# EAGLE design Pi Zero PITS (EAGLE 9.6.2)
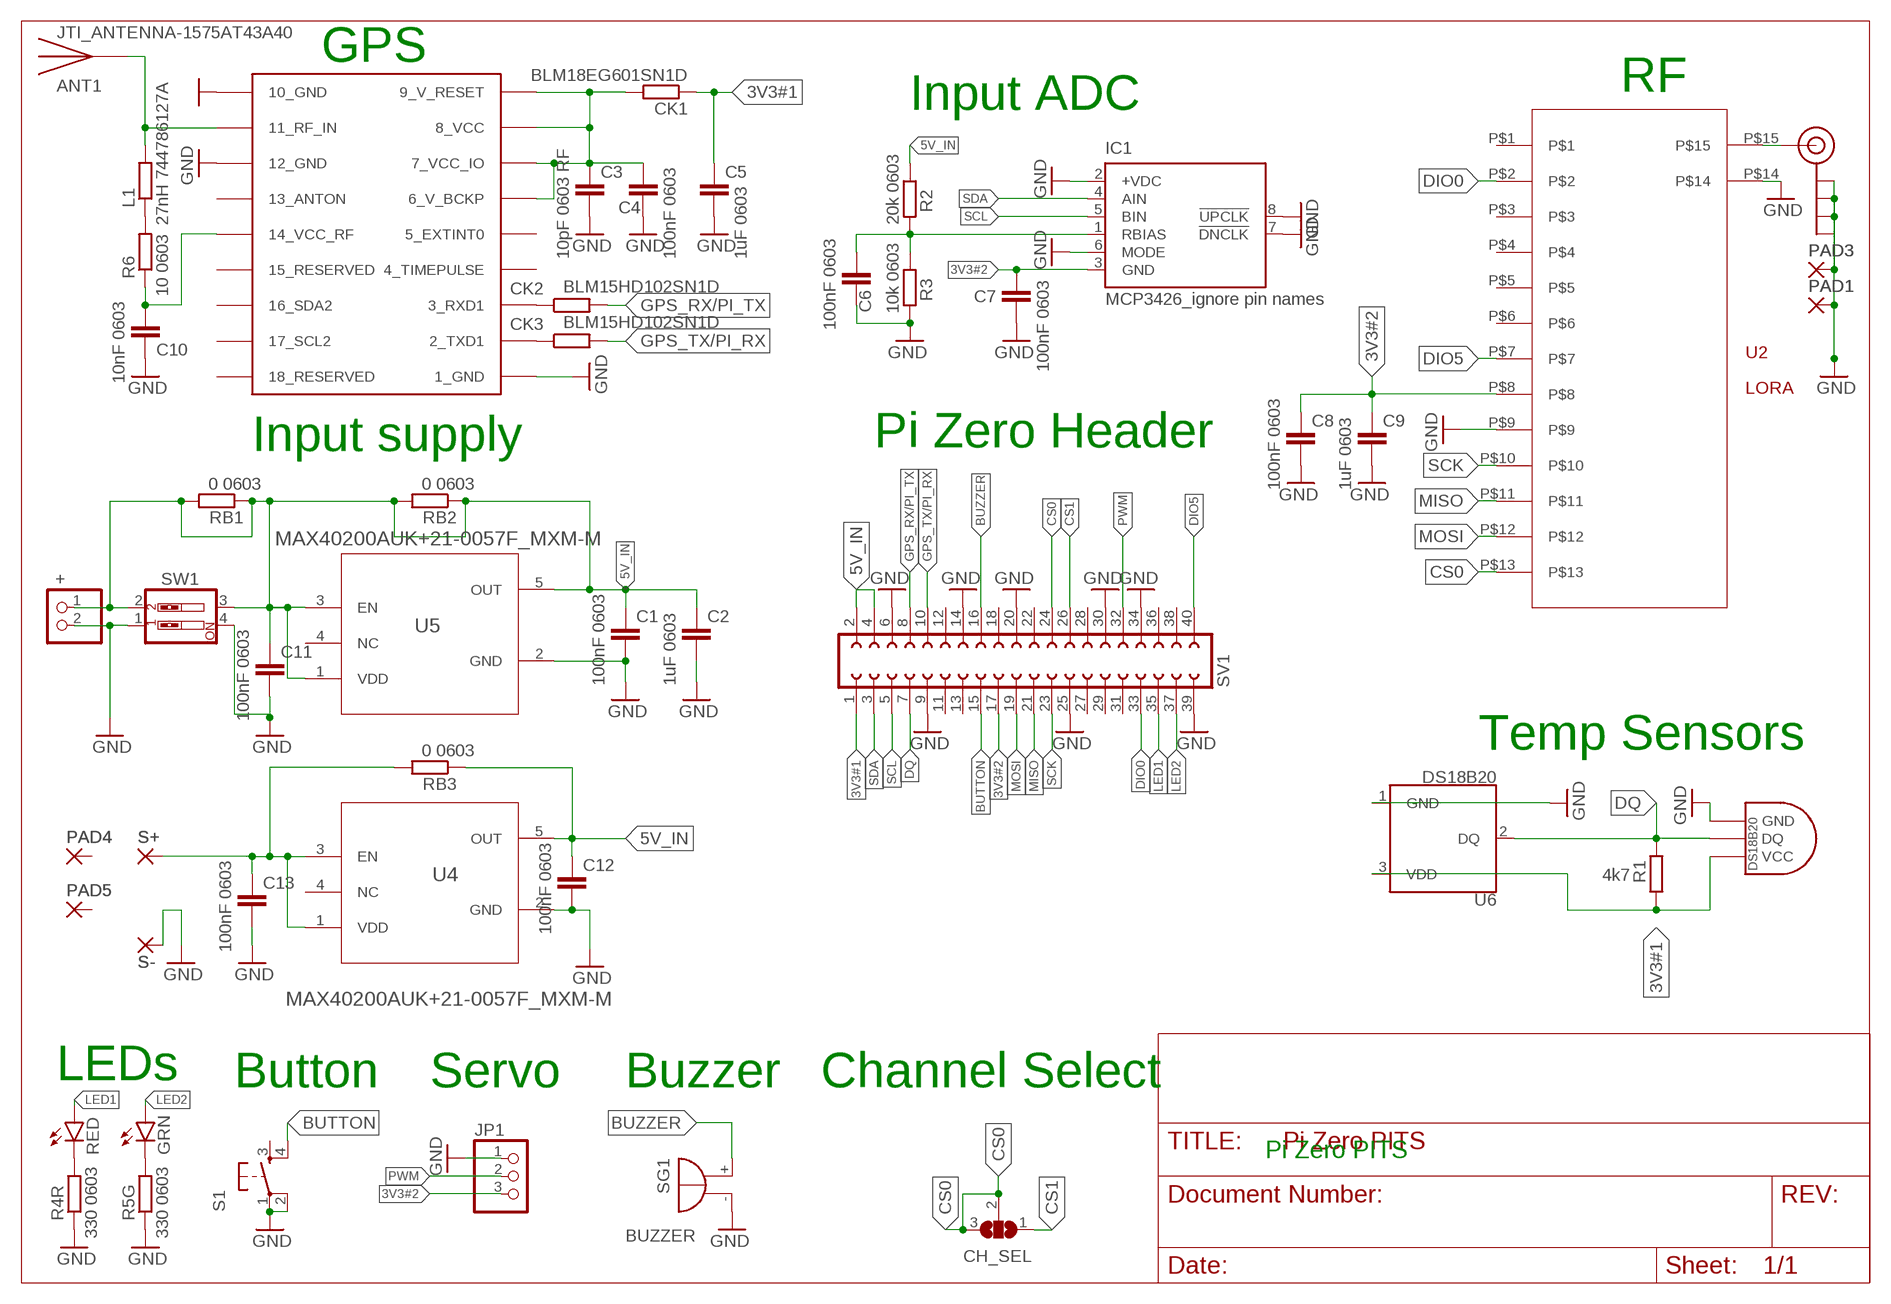
[diagram p0: schematic, sheet 1]

## Parts
18B20Z  DS1820SOIC  [DS18B20_SOIC]
+  PINHD-1X2  [1X02]
ANT1  JTI_ANTENNA-1575AT43A40  [JTI_ANTENNA-1575AT43A40]
C1  100nF 0603  C-EUC0603K  [C0603K]
C2  1uF 0603  C-EUC0603K  [C0603K]
C3  10pF 0603 RF  C-EUC0603K  [C0603K]
C4  100nF 0603  C-EUC0603K  [C0603K]
C5  1uF 0603  C-EUC0603K  [C0603K]
C6  100nF 0603  C-EUC0603K  [C0603K]
C7  100nF 0603  C-EUC0603K  [C0603K]
C8  100nF 0603  C-EUC0603K  [C0603K]
C9  1uF 0603  C-EUC0603K  [C0603K]
C10  10nF 0603  C-EUC0603K  [C0603K]
C11  100nF 0603  C-EUC0603K  [C0603K]
C12  100nF 0603  C-EUC0603K  [C0603K]
C13  100nF 0603  C-EUC0603K  [C0603K]
CH_SEL  SJ2W  [SJ_2]
CK1  BLM18EG601SN1D  R-EU_R0603  [R0603]
CK2  BLM15HD102SN1D  R-EU_R0402  [R0402]
CK3  BLM15HD102SN1D  R-EU_R0402  [R0402]
GRN  LEDSML0603  [SML0603]
IC1  MCP3426_ignore pin names  LS7183-SOIC  [SOIC08]
J$2  SMA_EDGE  [SMA-EDGE]
JP1  PINHD-1X3  [1X03]
L1  27nH 744786127A  R-EU_R0603  [R0603]
PAD1  SMD5  [SMD2,54-5,08]
PAD3  SMD5  [SMD2,54-5,08]
PAD4  SMD2SMD_KW  [SMD_SMALL]
PAD5  SMD2SMD_KW  [SMD_SMALL]
R1  4k7  R-EU_R0603  [R0603]
R2  20k 0603  R-EU_R0603  [R0603]
R3  10k 0603  R-EU_R0603  [R0603]
R4R  330 0603  R-EU_R0603  [R0603]
R5G  330 0603  R-EU_R0603  [R0603]
R6  10 0603  R-EU_R0603  [R0603]
RB1  0 0603  R-EU_R0603  [R0603]
RB2  0 0603  R-EU_R0603  [R0603]
RB3  0 0603  R-EU_R0603  [R0603]
RED  LEDSML0603  [SML0603]
S1  DTS-6  [DTS-6]
S+  SMD2SMD_KW  [SMD_SMALL]
S-  S-  SMD2SMD_KW  [SMD_SMALL]
SG1  BUZZER  BMT1205XH7.5  [BMT1205XH7.5]
SV1  FE20-2  [FE20-2]
SW1  SW_DIP-2  [EDG-02]
U1  U1  UBLOX_MAX-6  [UBLOX_MAX-6]
U2  LORA  [LORA_DRF]
U4  MAX40200AUK+21-0057F_MXM-M  [21-0057F_MXM-M]
U5  MAX40200AUK+21-0057F_MXM-M  [21-0057F_MXM-M]
U6  DS18B20  [TO-92-TO92127P495H2044-3]

## Nets
3V3#1: 18B20Z.VCC C5.1 CK1.1 R1.1 SV1.1 U6.3(VDD)
3V3#2: C7.1 C8.1 C9.1 IC1.3(GND) JP1.3 SV1.17 U2.P$8
5V_IN: +.1 C1.1 C2.1 C11.1 C12.1 R2.1 RB1.1 RB1.2 RB2.1 RB2.2 RB3.1 SV1.2 SV1.4 SW1.2 SW1.3 U4.5(OUT) U5.1(VDD) U5.3(EN) U5.5(OUT)
BUTTON: S1.4 SV1.15
BUZZER: SG1.+ SV1.16
CS0: CH_SEL.2 CH_SEL.3 SV1.24 U2.P$13
CS1: CH_SEL.1 SV1.26
DIO0: SV1.33 U2.P$2
DIO5: SV1.40 U2.P$7
DQ: 18B20Z.DQ R1.2 SV1.7 U6.2(DQ)
GND: 18B20Z.GND +.2 C1.2 C2.2 C3.2 C4.2 C5.2 C6.2 C7.2 C8.2 C9.2 C10.2 C11.2 C12.2 C13.2 IC1.2(+VDC) IC1.6(MODE) IC1.7(!DNCLK) IC1.8(!UPCLK) J$2.GND@0(GND) J$2.GND@1(GND) J$2.GND@2(GND) J$2.GND@3(GND) JP1.1 PAD1.1(P) PAD3.1(P) R3.2 R4R.1 R5G.1 S1.1 S1.2 S-.1(P) SG1.- SV1.6 SV1.9 SV1.14 SV1.20 SV1.25 SV1.30 SV1.34 SV1.39 SW1.1 SW1.4 U1.1_GND U1.10_GND U1.12_GND U2.P$9 U2.P$14 U4.2(GND) U5.2(GND) U6.1(GND)
GPS_RX/PI_TX: CK2.2 SV1.8
GPS_TX/PI_RX: CK3.2 SV1.10
LED1: RED.A SV1.35
LED2: GRN.A SV1.37
MISO: SV1.21 U2.P$11
MOSI: SV1.19 U2.P$12
N$2: J$2.SIG(SIGNAL) U2.P$15
N$3: GRN.C R5G.2
N$7: CK2.1 U1.3_RXD1
N$8: R4R.2 RED.C
N$9: CK3.1 U1.2_TXD1
N$11: C10.1 R6.1 U1.14_VCC_RF
N$14: ANT1.FEED L1.2 U1.11_RF_IN
N$15: C6.1 IC1.1(RBIAS) R2.2 R3.1
N$16: L1.1 R6.2
N$17: C3.1 C4.1 CK1.2 U1.6_V_BCKP U1.7_VCC_IO U1.8_VCC U1.9_V_RESET
N$19: C13.1 RB3.2 S+.1(P) U4.1(VDD) U4.3(EN)
PWM: JP1.2 SV1.32
SCK: SV1.23 U2.P$10
SCL: IC1.5(BIN) SV1.5
SDA: IC1.4(AIN) SV1.3
Unconnected: PAD4.1(P) PAD5.1(P) S1.3 SV1.11 SV1.12 SV1.13 SV1.18 SV1.22 SV1.27 SV1.28 SV1.29 SV1.31 SV1.36 SV1.38 U1.4_TIMEPULSE U1.5_EXTINT0 U1.13_ANTON U1.15_RESERVED U1.16_SDA2 U1.17_SCL2 U1.18_RESERVED U2.P$1 U2.P$3 U2.P$4 U2.P$5 U2.P$6 U4.4(NC) U5.4(NC)

## Notes on the sheet
- GPS
- RF
- Input ADC
- Input supply | Pi Zero Header
- Temp Sensors
- LEDs | Button | Servo | Buzzer | Channel Select
- Pi Zero PITS

## Library data of the parts
18B20Z = ava:DS1820: DS18B20 Programmable Resolution 1-Wire Digital Thermometer Description The DS18B20 digital thermometer provides 9-bit to 12-bit Celsius temperature measurements and has an alarm function with nonvolatile user-programmable upper and lower trigger points. The DS18B20 communicates over a 1-Wire® bus that by definition requires only one data line (and ground) for communication with a central microprocessor. It has an operating temperature range of -55°C to +125°C and is accurate to ±0.5°C over the range of -10°C to +85°C. In addition, the DS18B20 can derive power directly from the data line ("parasite power"), eliminating the need for an external power supply. Each DS18B20 has a unique 64-bit serial code, which allows multiple DS18B20s to function on the same 1-Wire bus. Thus, it is simple to use one microprocessor to control many DS18B20s distributed over a large area. Applications that can benefit from this feature include HVAC environmental controls, temperature monitoring systems inside buildings, equipment, or machinery, and process monitoring and control systems.
+ = pinhead:PINHD-1X2: PIN HEADER
ANT1 = KEW_HF_V13:JTI_ANTENNA-1575AT43A40
C1-C13 = rcl:C-EU: CAPACITOR, European symbol; SPICEPREFIX: C
CH_SEL = jumper:SJ2W: SMD solder JUMPER
CK1-CK3 L1 R1-R3 R4R R5G R6 RB1-RB3 = rcl:R-EU_: RESISTOR, European symbol; SPICEPREFIX: R
GRN RED = led:LED: LED OSRAM: - CHIPLED LG R971, LG N971, LY N971, LG Q971, LY Q971, LO R971, LY R971 LH N974, LH R974 LS Q976, LO Q976, LY Q976 LO Q996 - Hyper CHIPLED LW Q18S LB Q993, LB Q99A, LB R99A - SideLED LS A670, LO A670, LY A670, LG A670, LP A670 LB A673, LV A673, LT A673, LW A673 LH A674 LY A675 LS A676, LA A676, LO A676, LY A676, LW A676 LS A679, LY A679, LG A679 - Hyper Micro SIDELED® LS Y876, LA Y876, LO Y876, LY Y876 LT Y87S - SmartLED LW L88C, LW L88S LB L89C, LB L89S, LG L890 LS L89K, LO L89K, LY L89K LS L896, LA L896, LO L896, LY L896 - TOPLED LS T670, LO T670, LY T670, LG T670, LP T670 LSG T670, LSP T670, LSY T670, LOP T670, LYG T670 LG T671, LOG T671, LSG T671 LB T673, LV T673, LT T673, LW T673 LH T674 LS T676, LA T676, LO T676, LY T676, LB T676, LH T676, LSB T676, LW T676 LB T67C, LV T67C, LT T67C, LS T67K, LO T67K, LY T67K, LW E67C LS E67B, LA E67B, LO E67B, LY E67B, LB E67C, LV E67C, LT E67C LW T67C LS T679, LY T679, LG T679 LS T770, LO T770, LY T770, LG T770, LP T770 LB T773, LV T773, LT T773, LW T773 LH T774 LS E675, LA E675, LY E675, LS T675 LS T776, LA T776, LO T776, LY T776, LB T776 LHGB T686 LT T68C, LB T68C - Hyper Mini TOPLED® LB M676 - Mini TOPLED Santana® LG M470 LS M47K, LO M47K, LY M47K Source: http://www.osram.convergy.de LUXEON: - LUMILED® LXK2-PW12-R00, LXK2-PW12-S00, LXK2-PW14-U00, LXK2-PW14-V00 LXK2-PM12-R00, LXK2-PM12-S00, LXK2-PM14-U00 LXK2-PE12-Q00, LXK2-PE12-R00, LXK2-PE12-S00, LXK2-PE14-T00, LXK2-PE14-U00 LXK2-PB12-K00, LXK2-PB12-L00, LXK2-PB12-M00, LXK2-PB14-N00, LXK2-PB14-P00, LXK2-PB14-Q00 LXK2-PR12-L00, LXK2-PR12-M00, LXK2-PR14-Q00, LXK2-PR14-R00 LXK2-PD12-Q00, LXK2-PD12-R00, LXK2-PD12-S00 LXK2-PH12-R00, LXK2-PH12-S00 LXK2-PL12-P00, LXK2-PL12-Q00, LXK2-PL12-R00 Source: www.luxeon.com KINGBRIGHT: KA-3528ASYC Source: www.kingbright.com
IC1 = optocoupler:LS7183: Encoder to Counter Interface Source: http://www.usdigital.com/products/ls7183-ls7184/ls7183 ls7184 Data Sheet.pdf; OC_FARNELL: unknown; OC_NEWARK: unknown
J$2 = SparkFun:SMA_EDGE: SMA Antenna Connector End launch SMA connector. The paste layer has been removed so that the connector can be hand soldered onto the board after reflow.
JP1 = pinhead:PINHD-1X3: PIN HEADER
PAD1 PAD3 = wirepad:SMD5: SMD PAD
PAD4 PAD5 S+ S- = KEW_HF_V13:SMD2: SMD PAD
S1 = switch-tact:DTS-6
SG1 = buzzer:BMT1205XH7.5: MAGNETIC TRANSDUCER Source: Http:www.be-star.com; OC_FARNELL: unknown; OC_NEWARK: unknown
SV1 = con-lsta_new:FE20-2: FEMALE HEADER; OC_FARNELL: unknown; OC_NEWARK: unknown
SW1 = special:SW_DIP-2: DIP SWITCH
U1 = ava:UBLOX_MAX-6: UBLOX MAX-6
U2 = lora:LORA
U4 U5 = KEW_HF_V13:MAX40200AUK+; BUILT_BY: EMA_UL_Team; COPYRIGHT: Copyright (C) 2018 Accelerated Designs. All rights reserved; MANUFACTURER_PART_NUMBER: MAX40200AUK+; SOURCELIBRARY: Maxim_2018-11-30; VENDOR: Maxim Integrated Products
U6 = DS18B20:DS18B20: digital thermometer -55C-125C TO92-3 Check prices <https://pricing.snapeda.com/parts/DS18B20/Maxim%20Integrated/view-part?ref=eda>; AVAILABILITY: Bad; DESCRIPTION: Temperature Sensor Digital, Local -55°C ~ 125°C 12 b 8-SOIC; MF: Maxim Integrated; MP: DS18B20; PACKAGE: TO-226-3 Maxim; PRICE: None

## Net classes
0 default: width 0.152 mm, drill 0.305 mm, clearance 0.152 mm
1 vcc: width 0.152 mm, clearance 0.152 mm

## Board
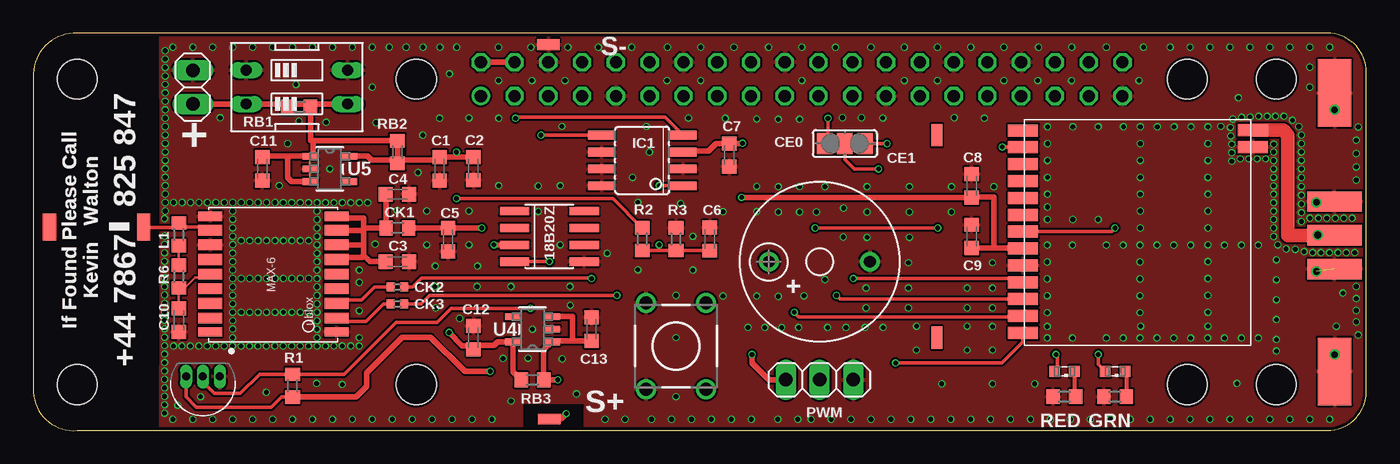
[diagram p1: board, top side]
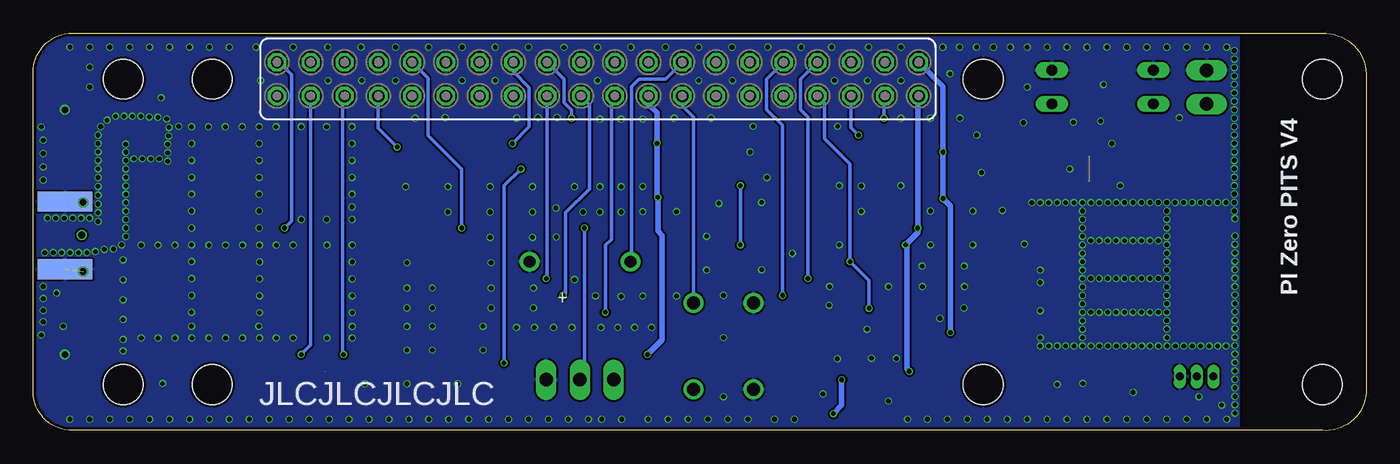
[diagram p2: board, bottom side, seen from below]

Size 100.25 x 29.9 mm. Coordinates in mm from the lower left corner, seen from the top.
Outline: 3.3,29.9 arc90 0,26.85 0,2.85 arc90 3.3,0.01 97.33,0.01 arc90 100.25,2.93 100.25,26.98 arc90 97.33,29.9 3.3,29.9
Copper layers (1*16): Top 0.035559375mm / dielectric 1.6mm / Bottom 0.035559375mm
Design rules "JLCpcb-2-layer-KW-Master": minimum track width 6mil, minimum drill 0.3mm, track to track 6mil, track to pad 6mil, pad to pad 6mil, via to via 10mil, smd to smd 6mil, copper to edge 8mil, drill to drill 6mil, minimum pad ring 5mil, minimum via ring 3mil, stop-mask expansion 2.5mil, vias tented up to drill 25mil, thermal gap 6mil
Holes 3 mm at 28.81,26.45 86.8,26.45 28.81,3.46 86.8,3.46 3.31,26.45 3.31,3.46 93.48,26.45 93.48,3.46
tKeepout: area 86.8,3.4 to 86.8,3.4; area 86.8,26.3 to 86.8,26.3; area 28.8,26.3 to 28.8,26.3; area 28.8,3.3 to 28.8,3.3
tRestrict: area 0,4.9 to 9.5,24.9; area 36.9,0 to 41.4,1.9; area 18.6,23.8 to 21.4,25; area 26.8,19.6 to 28,22.4

### Footprints (pad centres in the part's own frame; a part is rotated, then mirrored left to right if it is on the bottom)
DS18B20_SOIC = smd 0.61 x 2.21: DQ 1.905,-2.616; GND 1.905,2.616; NC -1.905,-2.616; NC2 -0.635,-2.616; NC3 -1.905,2.616; NC4 -0.635,2.616; NC5 0.635,2.616; VCC 0.635,-2.616
1X02 = drill 1.016 long: 1 -1.27,0; 2 1.27,0
JTI_ANTENNA-1575AT43A40 = smd 1 x 2: FEED -3.81,-1.27; NC 3.29,-1.27
C0603K = smd 1.05 x 1.08: 1 -0.875,0; 2 0.875,0
SJ_2 = smd 1.168 x 1.6: 1 -1.524,0; 2 0,0; 3 1.524,0
R0603 = smd 1 x 1.1: 1 -0.85,0; 2 0.85,0
R0402 = smd 0.6 x 0.7: 1 -0.5,0; 2 0.5,0
SML0603 = smd 0.8 x 0.8: A 0.75,0; C -0.75,0
SOIC08 = smd 0.66 x 2.032: 1 -1.905,-3.073; 2 -0.635,-3.073; 3 0.635,-3.073; 4 1.905,-3.073; 5 1.905,3.073; 6 0.635,3.073; 7 -0.635,3.073; 8 -1.905,3.073
SMA-EDGE = smd 1.524 x 4.064: GND@0 0,0; GND@1 5.08,0; SIG 2.54,0 | smd 1.524 x 4.064 bottom: GND@2 0,0; GND@3 5.08,0
1X03 = drill 1.016 long: 1 -2.54,0; 2 0,0; 3 2.54,0
SMD2,54-5,08 = smd 2.54 x 5.08: 1 0,0
SMD_SMALL = smd 0.813 x 1.676: 1 0,0
DTS-6 = drill 1: 1 -3.25,2.25; 2 3.25,2.25; 3 -3.25,-2.25; 4 3.25,-2.25
BMT1205XH7.5 = drill 0.9 pad 1.5: + 3.8,0; - -3.8,0
FE20-2 = drill 0.914: 1 -24.13,1.27 | drill 0.914 octagon: 2 -24.13,-1.27; 3 -21.59,1.27; 4 -21.59,-1.27; 5 -19.05,1.27; 6 -19.05,-1.27; 7 -16.51,1.27; 8 -16.51,-1.27; 9 -13.97,1.27; 10 -13.97,-1.27; 11 -11.43,1.27; 12 -11.43,-1.27; 13 -8.89,1.27; 14 -8.89,-1.27; 15 -6.35,1.27; 16 -6.35,-1.27; 17 -3.81,1.27; 18 -3.81,-1.27; 19 -1.27,1.27; 20 -1.27,-1.27; 21 1.27,1.27; 22 1.27,-1.27; 23 3.81,1.27; 24 3.81,-1.27; 25 6.35,1.27; 26 6.35,-1.27; 27 8.89,1.27; 28 8.89,-1.27; 29 11.43,1.27; 30 11.43,-1.27; 31 13.97,1.27; 32 13.97,-1.27; 33 16.51,1.27; 34 16.51,-1.27; 35 19.05,1.27; 36 19.05,-1.27; 37 21.59,1.27; 38 21.59,-1.27; 39 24.13,1.27; 40 24.13,-1.27
EDG-02 = drill 0.813 long: 1 -1.27,-3.81; 2 1.27,-3.81; 3 1.27,3.81; 4 -1.27,3.81
UBLOX_MAX-6 = smd 1.8 x 0.7: 1_GND 4.95,-4.4; 9_V_RESET 4.95,4.3; 10_GND -4.55,4.3; 18_RESERVED -4.55,-4.4 | smd 1.8 x 0.8: 2_TXD1 4.95,-3.35; 3_RXD1 4.95,-2.25; 4_TIMEPULSE 4.95,-1.15; 5_EXTINT0 4.95,-0.05; 6_V_BCKP 4.95,1.05; 7_VCC_IO 4.95,2.15; 8_VCC 4.95,3.25; 11_RF_IN -4.55,3.25; 12_GND -4.55,2.15; 13_ANTON -4.55,1.05; 14_VCC_RF -4.55,-0.05; 15_RESERVED -4.55,-1.15; 16_SDA2 -4.55,-2.25; 17_SCL2 -4.55,-3.35
LORA_DRF = smd 2.27 x 0.9: P$1 -8.609,7.497; P$2 -8.609,6.227; P$3 -8.608,4.958; P$4 -8.608,3.688; P$5 -8.609,2.417; P$6 -8.609,1.147; P$7 -8.608,-0.122; P$8 -8.608,-1.392; P$9 -8.61,-2.663; P$10 -8.61,-3.933; P$11 -8.609,-5.202; P$12 -8.609,-6.472; P$13 -8.609,-7.743; P$14 8.673,6.235; P$15 8.675,7.506
21-0057F_MXM-M = smd 1.181 x 0.508: 1 -1.467,0.95; 2 -1.467,0; 3 -1.467,-0.95; 4 1.467,-0.95; 5 1.467,0.95
TO-92-TO92127P495H2044-3 = drill 0.6 pad 0.813 long: 1 -1.27,-0.76; 2 0,-0.76; 3 1.27,-0.76

### Placement (x,y rotation side)
18B20Z  38.81,14.61 270 top
+  12,25.85 90 top
ANT1  4.5,14.05 180 top
C1  30.56,19.69 270 top
C2  33.1,19.72 270 top
C3  27.38,12.71 0 top
C4  27.38,17.79 0 top
C5  31.2,14.36 270 top
C6  50.88,14.41 90 top
C7  52.35,20.73 270 top
C8  70.56,18.42 90 top
C9  70.56,14.61 90 top
C10  10.95,8.31 270 top
C11  17.23,19.69 270 top
C12  33.1,6.99 90 top
C13  41.99,7.63 90 top
CH_SEL  61.04,21.6 180 top
CK1  27.38,15.25 180 top
CK2  27.38,10.8 0 top
CK3  27.38,9.53 0 top
GRN  81.36,4.45 180 top
IC1  45.8,20.33 90 top
J$2  97.86,12.15 90 top
JP1  59.14,3.82 180 top
L1  10.95,14.77 90 top
PAD1  97.87,4.45 180 top
PAD3  97.87,25.41 180 top
PAD4  67.96,22.23 0 top
PAD5  67.96,6.99 0 top
R1  19.51,3.38 90 top
R2  45.8,14.41 270 top
R3  48.34,14.41 90 top
R4R  77.55,2.55 0 top
R5G  81.36,2.55 0 top
R6  10.95,11.59 90 top
RB1  20,24.35 180 top
RB2  27.38,20.96 90 top
RB3  37.55,3.82 0 top
RED  77.55,4.45 180 top
S1  48.34,6.36 90 top
S+  38.81,0.87 90 top
S-  38.74,29.04 90 top
SG1  59.14,12.71 180 top
SV1  57.79,26.45 180 bottom
SW1  19.83,25.85 270 top
U1  17.86,11.82 0 top
U2  83.04,15.09 0 top
U4  37.55,7.63 180 top
U5  22.3,19.69 0 top
U6  12.75,3.31 180 top

### Tracks (layer width: path | path; a pad name or v marks a point on that pad's centre or on a via)
3V3#1  (via drill 0.35)  (1 unrouted)
  Top 0.254: R1.1 18.67,2.53 17.88,1.74 12.27,1.74 11.48,2.53 U6.3
  Top 0.406: CK1.1 31.18,15.25 C5.1 33.72,15.23 v33.73,15.25 | 18B20Z.VCC v34.65,13.98 | v34.37,4.45 32.47,4.45 29.9,7.02 27.74,7.02 25.07,4.35 25.07,3.31 24.29,2.53 R1.1
  Bottom 0.406: SV1.1 33.73,25.1 v33.73,15.25 33.73,14.89 v34.65,13.98 34.55,13.88 34.55,4.63 v34.37,4.45
3V3#2  (via drill 0.35)
  Top 0.406: U2.P$8 74.4,13.74 72.25,13.74 | 72.25,13.74 C9.1 | v53.28,17.55 C8.1 70.6,17.59 72.24,17.59 72.24,13.75 72.25,13.74 | IC1.3 48.95,21.04 50.79,21.04 51.36,21.61 C7.1 53.33,21.61 v53.34,21.62 | v54.05,5.72 54.05,5.09 55.33,3.82 JP1.3
  Bottom 0.406: SV1.17 53.98,24.54 53.34,23.91 v53.34,21.62 53.34,17.61 v53.28,17.55 53.28,15.01 52.96,14.69 52.96,6.82 v54.05,5.72
5V_IN  (via drill 0.35)  (1 unrouted)
  Top 0.254: 45.79,15.25 R2.1 43.6,17.46 v31.83,17.46
  Top 0.406: SV1.2 SV1.4 | U5.5 25.15,20.64 25.43,20.37 27.13,20.37 RB2.1 | RB2.1 27.64,20.37 30.36,20.37 C1.1 31.83,20.57 | C2.1 33.08,20.57 31.83,20.57 | v31.83,20.96 31.83,20.57 | U4.5 34.93,6.68 34.65,6.4 33.38,6.4 C12.1 32.84,6.38 32.26,6.38 v31.27,7.37 | U4.5 | RB3.1 36.08,4.44 U4.5 | 18.92,24.58 RB1.2 18.91,24.58 SW1.2 | +.1 SW1.2 | RB1.1 21.1,24.6 | RB1.1 20.85,24.19 | 19.13,20.64 U5.1 21.04,20.84 21.04,21.81 | 19.13,20.64 17.3,20.64 C11.1 | 21.04,21.81 20.85,21.81 RB1.1 | 21.04,21.81 RB2.2 RB2.1 | U5.3 19.45,18.74 19.13,19.06 19.13,20.64 | RB1.1 21.09,24.58 SW1.3 SW1.2
  Bottom 0.406: SV1.2 31.83,25.89 v31.83,20.96 v31.83,17.46 31.27,16.9 v31.27,7.37
BUTTON
  Bottom 0.254: 51.46,25.18 SV1.15 51.44,24.43 50.59,23.58 S1.4
BUZZER
  Bottom 0.254: SG1.+ 55.26,12.78 55.26,25.87 54.68,26.45 52.71,26.45 SV1.16
CS0  (via drill 0.35)
  Top 0.254: v59.77,23.5 59.77,21.85 CH_SEL.3 CH_SEL.2 61.04,20.4 61.75,19.69 v63.58,19.69 | v64.85,5.09 72.84,5.09 74.44,6.68 U2.P$13
  Bottom 0.254: v59.77,23.5 59.77,24.12 60.33,24.68 60.33,26.45 SV1.24 | v63.58,19.69 64.85,18.42 v64.85,5.09
CS1  (via drill 0.35)
  Top 0.254: CH_SEL.1 v64.22,21.6
  Bottom 0.254: SV1.26 64.14,27 62.94,25.81 62.94,22.87 v64.22,21.6
DIO0  (via drill 0.35)
  Top 0.203: U2.P$2 74.53,21.32
  Top 0.254: 74.33,21.42 U2.P$2 74.41,21.34 v72.88,21.34
  Bottom 0.254: v72.88,21.34 74.3,22.77 SV1.33
DIO5  (via drill 0.35)
  Top 0.254: U2.P$7 74.46,14.99 81.11,14.99 v81.36,15.25
  Bottom 0.254: v81.36,15.25 80.83,15.78 80.83,26.78 81.77,27.72 SV1.40
DQ  (via drill 0.35)
  Top 0.254: v38.81,12.71 18B20Z.DQ | v37.39,9.2 31.42,9.2 30.36,8.14 27.28,8.14 23.37,4.23 R1.2 17.01,4.23 15.57,2.79 13.62,2.79 12.75,3.66 U6.2
  Bottom 0.254: SV1.7 40.73,24.63 40.73,21.97 38.81,20.05 v38.81,12.71 37.39,11.29 v37.39,9.2
GND  (via drill 0.35, 0.5)  (1 unrouted)
  other vias: 99.5,18.85 79.5,0.85 81,0.85 78,0.85 76.5,0.85 75,0.85 82.5,0.85 96,25.85 93.5,11.35 93.5,12.85 93.5,9.85 93.5,8.35 93.5,6.85 93.5,5.98 97.5,28.85 96,28.85 93,0.85 94.5,0.85 91.5,0.85 88.5,0.85 85.5,0.85 84,0.85 88.5,28.85 93,28.85 94.5,28.85 68,26.35 90,28.85 91.5,28.85 83.5,28.85 85.5,28.85 87,28.85 70.5,0.85 72,0.85 69,0.85 67.5,0.85 73.5,0.85 98.5,10.35 99.65,22.85 96,27.35 65.5,28.85 70.5,28.85 80.7,28.85 78.1,28.85 99.5,9.04 75.6,28.85 73,28.85 65.5,26.35 73,26.35 57.5,0.85 58.5,0.85 56,0.85 54,0.85 60,0.85 64.5,0.85 66,0.85 63,0.85 61.5,0.85 51,0.85 49.5,0.85 48,0.85 52.5,0.85 68,28.85 37.5,26.35 35,26.35 55.3,28.85 52.7,28.85 44.5,0.85 43,0.85 34.5,0.85 33,0.85 46.5,0.85 31.5,0.85 30,0.85 28.5,0.85 57.8,28.85 60.33,28.84 63,28.85 50.2,28.85 47.7,28.85 16.5,0.85 18,0.85 45,28.85 15,28.85 22.5,28.85 25.5,28.85 35,28.85 42.5,28.85 27,0.85 25.5,0.85 24,0.85 22.5,0.85 19.5,0.85 21,0.85 13.5,28.85 10.5,28.85 12,28.85 24.53,11.14 24.53,9.02 21.34,6.99 40,26.35 31.3,26.85 13.5,0.85 12,0.85 37.42,28.85 15,0.85 10.5,0.85 24,28.85 40.2,28.85 99.5,21.85 90.88,23.58 99.5,20.85 99.5,19.85 87,0.85 91.52,23.61 90,0.85 96,0.85 97.5,0.85 97.87,5.72 99.5,10.85 99.5,9.93 98,7.85 25.5,25.85 15,7.64 14.99,6.99 19.5,28.85 18,28.85 16.5,28.85 21,28.85 50.2,26.35 57.8,26.35 97.87,24.14 96.5,11.97 96.5,17.17 92.79,23.66 92.16,23.66 93.43,23.66 94.06,23.66 94.7,23.35 95.18,22.87 95.38,22.24 95.38,21.6 95.38,20.97 95.38,20.33 95.38,19.7 95.38,19.04 95.38,18.37 95.38,17.71 95.38,17.05 95.38,16.39 95.38,15.73 96.02,15.99 96.65,15.99 97.29,15.99 97.92,15.99 98.56,15.99 99.19,15.99 93.3,21.55 90.22,23.45 90.04,22.81 90.06,22.18 90.14,21.54 90.14,20.91 90.14,20.27 90.78,20.45 91.41,20.45 92.05,20.45 92.68,20.45 93.29,20.32 93.29,19.69 93.29,20.96 93.29,19.05 93.29,18.42 93.29,17.78 93.29,17.15 93.29,16.51 93.29,15.88 93.29,15.24 93.29,14.61 93.59,13.97 94.23,13.67 94.92,13.64 95.58,13.47 96.21,13.39 96.85,13.39 97.48,13.39 98.12,13.39 98.75,13.39 99.39,13.39 75.54,26.35 78.08,26.35 83.16,26.35 15,8.27 15,8.91 15,9.54 15,10.18 15,10.81 15,11.45 15,12.08 15,12.72 15,13.35 15,13.99 15,14.62 15,15.26 15,15.89 15,16.53 14.99,6.36 21.34,6.36 21.34,7.63 21.34,8.26 21.34,8.9 21.34,9.53 21.34,10.17 21.34,10.8 21.34,11.44 21.34,12.07 21.34,12.71 21.34,13.34 21.34,13.98 21.34,14.61 21.34,15.25 21.34,15.88 21.34,16.52 21.34,17.15 20.7,17.15 20.07,17.15 19.43,17.15 18.8,17.15 15.64,17.16 16.27,17.16 16.91,17.16 17.54,17.16 18.18,17.16 15.62,6.36 16.26,6.36 16.89,6.36 17.53,6.36 18.16,6.36 18.8,6.36 19.43,6.36 20.07,6.36 20.7,6.36 15.64,11.45 15.64,8.91 15.64,14.29 16.27,14.29 16.91,14.29 17.54,14.29 18.18,14.29 18.81,14.29 19.45,14.29 20.08,14.29 20.71,14.29 16.27,11.45 16.91,11.45 17.54,11.45 18.18,11.45 18.81,11.45 19.45,11.45 20.08,11.45 20.71,11.45 16.27,8.91 16.91,8.91 17.54,8.91 18.18,8.91 18.81,8.91 19.45,8.91 20.08,8.91 20.71,8.91 99.5,8.18 99.65,7.19 26.77,28.85 28.04,28.85 29.31,28.85 30.58,28.85 31.85,28.85 15,17.16 14.36,17.16 13.73,17.16 13.09,17.16 12.46,17.16 11.82,17.16 11.19,17.16 10.55,17.16 9.92,17.16 9.87,15.94 9.87,14.65 9.92,16.53 9.87,14.01 9.87,13.38 9.87,12.74 9.87,12.11 9.87,11.47 9.87,10.84 9.87,10.2 9.87,9.57 9.87,8.93 9.87,8.3 9.87,7.66 9.87,7.03 9.87,6.39 9.87,5.76 9.87,5.12 9.87,4.49 9.87,3.85 9.87,3.22 9.87,2.58 9.87,1.95 9.87,1.31 9.92,17.8 9.92,18.43 9.92,19.07 9.92,19.7 9.92,20.34 9.92,20.97 9.92,21.61 9.92,22.24 9.92,22.88 9.92,23.51 9.92,24.15 9.92,24.78 9.92,25.42 9.92,26.05 9.92,26.69 9.92,27.32 9.92,27.96 9.92,28.59 22.3,19.69 37.55,7.63 39.63,13.98 37.98,16.49 37.98,18.4 39.63,18.42 19.13,21.6 18.5,18.42 19.77,26.04 22.03,23.2 29.29,22.23 30.56,23.5 32.77,23.53 35.01,23.5 35.01,18.42 39.75,22.89 47.66,26.35 46.1,22.89 49.28,23.53 45.47,17.18 45.47,12.1 49.61,14.61 49.61,12.07 48.34,10.17 48.34,6.99 48.34,2.55 21.31,3.54 23.24,3.46 32.06,8.44 35.34,5.42 37.21,5.44 39.78,5.39 40.39,9.43 40.36,10.83 35.92,10.83 33.38,10.83 30.26,9.23 30.23,12.38 33.4,12.38 43.16,13.34 45.06,19.06 46.33,20.96 52.05,23.5 54.41,23.45 56.04,23.43 57.64,23.43 60.86,23.55 62.28,23.55 63.88,23.53 69.27,23.55 71.53,23.5 76.28,22.87 78.19,22.87 80.09,22.87 78.16,6.97 80.7,6.97 81.97,6.97 83.24,6.97 84.51,6.97 85.78,6.97 87.05,6.97 88.32,6.97 89.59,6.97 90.86,6.97 92.13,6.97 76.25,6.97 82,22.87 83.27,22.87 84.53,22.87 85.81,22.87 87.08,22.87 88.34,22.87 89.31,22.89 88.34,21.6 88.34,20.33 88.34,19.06 88.34,17.79 88.34,16.52 88.34,15.25 88.34,13.98 88.34,12.71 88.34,11.44 88.34,10.17 88.34,8.9 88.34,7.86 76.25,13.95 78.16,13.95 78.19,15.88 76.28,15.88 80.7,13.95 81.97,13.95 83.24,13.95 84.51,13.95 85.78,13.95 87.05,13.95 89.59,13.95 90.86,13.95 92.13,13.95 54.41,18.37 56.04,18.35 57.64,18.35 59.54,18.35 62.72,18.35 65.89,18.35 69.07,18.35 72.24,18.35 54.41,16.47 56.04,16.44 57.64,16.44 62.72,16.44 65.89,16.44 69.07,16.44 62.72,14.54 65.89,14.54 54.41,10.12 56.04,10.09 57.97,10.14 59.54,11.36 60.91,14.56 62.64,10.73 65.82,10.73 62.64,9.23 65.82,9.23 62.56,7.76 59.74,7.76 57.56,7.76 72.14,10.73 72.14,9.23 72.14,7.83 72.14,6.05 66.42,6.05 66.44,7.86 68.33,3.51 72.14,3.51 51.87,10.12 51.87,16.47 48.7,17.1 40.87,2.75 35.94,2.22 10.88,1.91 14.35,6.36 13.72,6.36 13.08,6.36 12.45,6.36 11.81,6.36 11.18,6.36 10.54,6.36 21.97,6.36 22.61,6.36 23.24,6.36 23.88,6.36 24.51,6.36 21.97,17.15 22.61,17.15 23.24,17.15 23.88,17.15 24.51,17.15 25.15,17.15 29.59,16.52 29.59,13.98 32.77,13.98 32.77,16.52 56.29,7.76 55.02,7.76 53.75,7.76 61.12,7.76 63.91,7.76 70.23,7.86 70.23,6.05 70.23,10.73 70.23,9.23 58.91,16.44 60.94,16.75 83.27,21.6 83.27,20.33 83.27,19.06 83.27,17.79 83.27,16.52 83.27,15.25 83.24,12.68 83.24,11.41 83.24,10.14 83.24,8.87 83.29,7.86 76.28,21.6 76.28,20.33 76.28,19.06 76.28,17.79 76.28,16.82 76.25,12.68 76.25,11.41 76.25,10.14 76.25,8.87 76.25,7.83 80.09,15.88 17.53,2.88 12.58,2.55 14.06,23.54 19.98,23.28 25.78,23.17 28.93,19.41 27.36,16.57 25.71,14.03 72.14,12.63 65.82,12.63 75.31,3.51 90.64,25.04 90.53,3.54 30.2,10.83 24.51,6.99 24.51,12.07
  pour Top: 9.56,30.23 100.71,30.23 100.71,-0.23 9.56,-0.23
  pour Bottom: 9.55,30.23 100.71,30.23 100.71,-0.22 9.55,-0.22
GPS_RX/PI_TX  (via drill 0.35)
  Top 0.254: v41.99,11.44 41.94,11.49 29.21,11.49 28.52,10.8 CK2.2
  Bottom 0.254: v41.99,11.44 41.99,23.59 42.55,24.15 42.55,26.45 SV1.8
GPS_TX/PI_RX  (via drill 0.35)
  Top 0.254: CK3.2 29.16,9.53 29.79,10.17 v43.9,10.17
  Bottom 0.254: SV1.10 45.09,26.44 45.09,24.17 43.9,22.98 v43.9,10.17
LED1  (via drill 0.35)
  Top 0.2: v76.92,5.72 77,5.63 | 77,4.66 RED.A
  Top 0.254: 77,5.63 77,4.66
  Top 0.305: RED.A 76.84,4.5
  Bottom 0.254: v76.92,5.72 77,5.81 77,25.02 SV1.35
LED2  (via drill 0.35)
  Top 0.254: v80.09,5.72 80.09,4.97 GRN.A
  Bottom 0.254: SV1.37 79.38,6.43 v80.09,5.72
MISO  (via drill 0.35)
  Top 0.254: U2.P$11 60.68,9.89 v60.41,10.17
  Bottom 0.254: SV1.21 58.42,24.54 58.42,18.19 60.23,16.39 60.23,10.35 v60.41,10.17
MOSI  (via drill 0.35)
  Top 0.254: v57.23,8.9 57.56,8.57 74.38,8.57 U2.P$12
  Bottom 0.254: SV1.19 56.77,24.93 56.77,14.38 57.2,13.95 57.2,8.92 v57.23,8.9
N$2
  Top 1.016: J$2.SIG 94.34,14.69 94.34,22.25 93.99,22.6 U2.P$15
N$3
  Top 0.305: GRN.C 82.21,4.35 R5G.2
N$7
  Top 0.2: U1.3_RXD1 23.06,9.83
  Top 0.254: 23.06,9.83 24.71,9.83 25.69,10.8 CK2.1
N$8  (1 unrouted)
  Top 0.152: RED.C 78.29,4.4
  Top 0.305: R4R.2 78.3,2.65 RED.C
N$9
  Top 0.2: U1.2_TXD1 23.06,8.22
  Top 0.254: U1.2_TXD1 23.12,8.47 | 23.06,8.22 25.04,8.22 26.35,9.53 CK3.1
N$10  (via drill 0.5)
  other vias: 96.6,14.71
N$11
  Top 0.2: C10.1 10.95,9.34 R6.1 11.44,10.76 12.2,11.52 13.05,11.52 U1.14_VCC_RF
N$14
  Top 0.152: L1.2 10.97,15.49
  Top 0.254: ANT1.FEED 8.34,15.3 10.78,15.3 L1.2 11.42,15.32 13.06,15.32 U1.11_RF_IN
N$15  (via drill 0.35)
  Top 0.254: R2.2 47.07,13.56 | v47.07,18.42 IC1.1 | 47.07,13.56 R3.1 50.85,13.56 C6.1 | v47.07,13.98 47.07,13.56
  Bottom 0.254: v47.07,13.98 v47.07,18.42
N$16
  Top 0.2: L1.1 10.95,13.76 R6.2
N$17
  Top 0.406: 26.51,15.22 CK1.2 | U1.6_V_BCKP 22.96,13.03 24.68,13.03 24.84,13.19 | U1.7_VCC_IO 24.84,13.97 24.84,13.98 | U1.8_VCC 24.84,15.07 | 24.84,15.07 | U1.9_V_RESET 22.93,16 24.84,16 24.84,15.25 | 24.84,15.25 24.84,15.08 | 24.84,15.08 24.84,15.07 | 24.84,15.08 24.84,13.98 | CK1.2 24.84,15.25 | 24.84,13.19 24.84,13.98 | C3.1 25.33,12.71 24.84,13.19 | CK1.2 26.54,17.76 C4.1
  Top 0.508: U1.9_V_RESET 22.74,16.19
N$19  (via drill 0.35)
  Top 0.406: 40.54,6.75 39.09,6.75 U4.1 38.4,6.06 RB3.2 v39.45,3.82 | 40.54,6.75 C13.1 | U4.3 39.03,8.59 40.54,8.59 40.54,6.75 | v40.09,1.28 39.68,0.87 S+.1
  Bottom 0.406: v39.45,3.82 39.45,1.91 v40.09,1.28
PWM  (via drill 0.35)
  Top 0.254: v58.8,15.25 v68.03,15.25
  Bottom 0.254: v58.8,15.25 58.8,4.15 JP1.2 | v68.03,15.25 68.03,19.67 70.56,22.21 70.56,26.53 SV1.32
SCK  (via drill 0.35)
  Top 0.254: U2.P$10 74.16,11.44 v61.68,11.44 v61.67,11.44
  Bottom 0.254: SV1.23 61.6,11.51 v61.67,11.44
SCL  (via drill 0.35)
  Top 0.254: IC1.5 v38.18,22.23
  Bottom 0.254: v38.18,22.23 38.74,22.79 SV1.5
SDA  (via drill 0.35)
  Top 0.254: IC1.4 47.52,23.59 36.36,23.59 v36.27,23.5
  Bottom 0.254: SV1.3 36.27,25.1 v36.27,23.5

### Text on the board
tNames: CE0 | CE1 | If Found Please Call / Kevin Walton | If Found Please Call / Kevin Walton | +44 7867 825 847 | + | PWM
bNames: PI Zero PITS V4 | + | JLCJLCJLCJLC